# EAGLE design US (EAGLE 8.5.1)
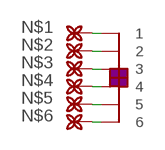
[diagram p0: schematic, sheet 1]

## Parts
C1  6P6C_FEMALESMD  [6P6C_FEMALE]
PAD1  BETTERPAD_2.54  [SUPERIORSIM]
PAD2  BETTERPAD_2.54  [SUPERIORSIM]
PAD3  BETTERPAD_2.54  [SUPERIORSIM]
PAD4  BETTERPAD_2.54  [SUPERIORSIM]
PAD5  BETTERPAD_2.54  [SUPERIORSIM]
PAD6  BETTERPAD_2.54  [SUPERIORSIM]

## Nets
N$1: C1.1 PAD1..(P)
N$2: C1.2 PAD2..(P)
N$3: C1.3 PAD3..(P)
N$4: C1.4 PAD4..(P)
N$5: C1.5 PAD5..(P)
N$6: C1.6 PAD6..(P)

## Library data of the parts
C1 = Yijiano:6P6C_FEMALE
PAD1-PAD6 = Yijiano:BETTERPAD_2.54

## Board
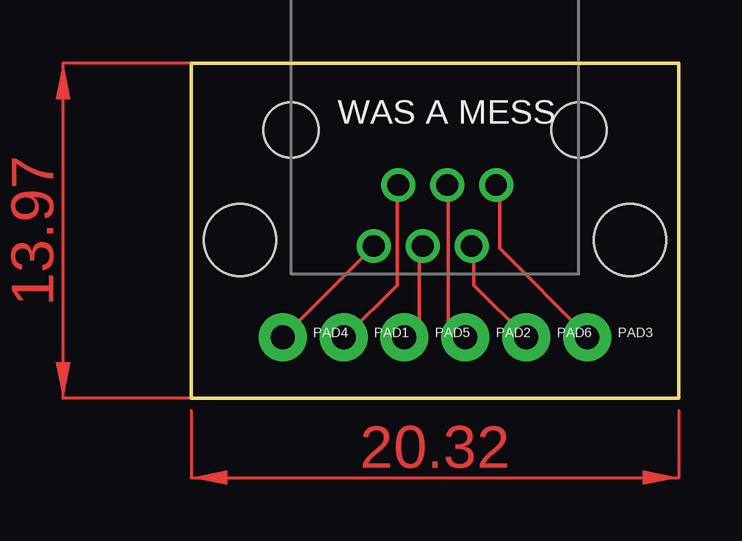
[diagram p1: board, top side]

Size 20.32 x 13.97 mm. Coordinates in mm from the lower left corner, seen from the top.
Outline: 0,0 20.32,0 20.32,13.97 0,13.97 0,0
Copper layers (1*16): Top 0.035mm / dielectric 1.5mm / Bottom 0.035mm
Design rules "default": minimum track width 6mil, minimum drill 0.35mm, track to track 6mil, track to pad 6mil, pad to pad 6mil, via to via 6mil, smd to smd 6mil, copper to edge 40mil, drill to drill 6mil, minimum pad ring 10mil, minimum via ring 8mil, stop-mask expansion 4mil, vias tented up to drill 0mil, thermal gap 10mil
Holes 3 mm at 2.03,6.6 18.29,6.6

### Footprints (pad centres in the part's own frame; a part is rotated, then mirrored left to right if it is on the bottom)
6P6C_FEMALE = drill 0.9 pad 1.3: 1 -1.53,1.27; 2 0.51,1.27; 3 2.55,1.27; 4 -2.55,-1.27; 5 -0.51,-1.27; 6 1.53,-1.27 | hole 2.3: 6,3.57; -6,3.57
SUPERIORSIM = drill 1 pad 2: . 0,0

### Placement (x,y rotation side)
C1  10.16,7.62 0 top
PAD1  6.35,2.54 0 top
PAD2  11.43,2.54 0 top
PAD3  16.51,2.54 0 top
PAD4  3.81,2.54 0 top
PAD5  8.89,2.54 0 top
PAD6  13.97,2.54 0 top

### Tracks (layer width: path | path; a pad name or v marks a point on that pad's centre or on a via)
N$1
  Top 0.152: C1.1 8.59,8.84 8.59,4.72 6.45,2.59 PAD1..
N$2
  Top 0.152: C1.2 10.72,8.84 10.72,3.2 11.33,2.59 PAD2..
N$3
  Top 0.152: C1.3 12.85,8.84 12.85,6.25 16.51,2.59 PAD3..
N$4
  Top 0.152: PAD4.. 7.52,6.25 C1.4
N$5
  Top 0.152: C1.5 9.5,6.25 9.5,3.2 8.89,2.59 PAD5..
N$6
  Top 0.152: PAD6.. 11.79,4.72 11.79,6.25 C1.6
(copper drawn outside any net)
  shapes: Top area x2

### Text on the board
tPlace: WAS A MESS